# EAGLE design Main_Board_SW (EAGLE 6.4)
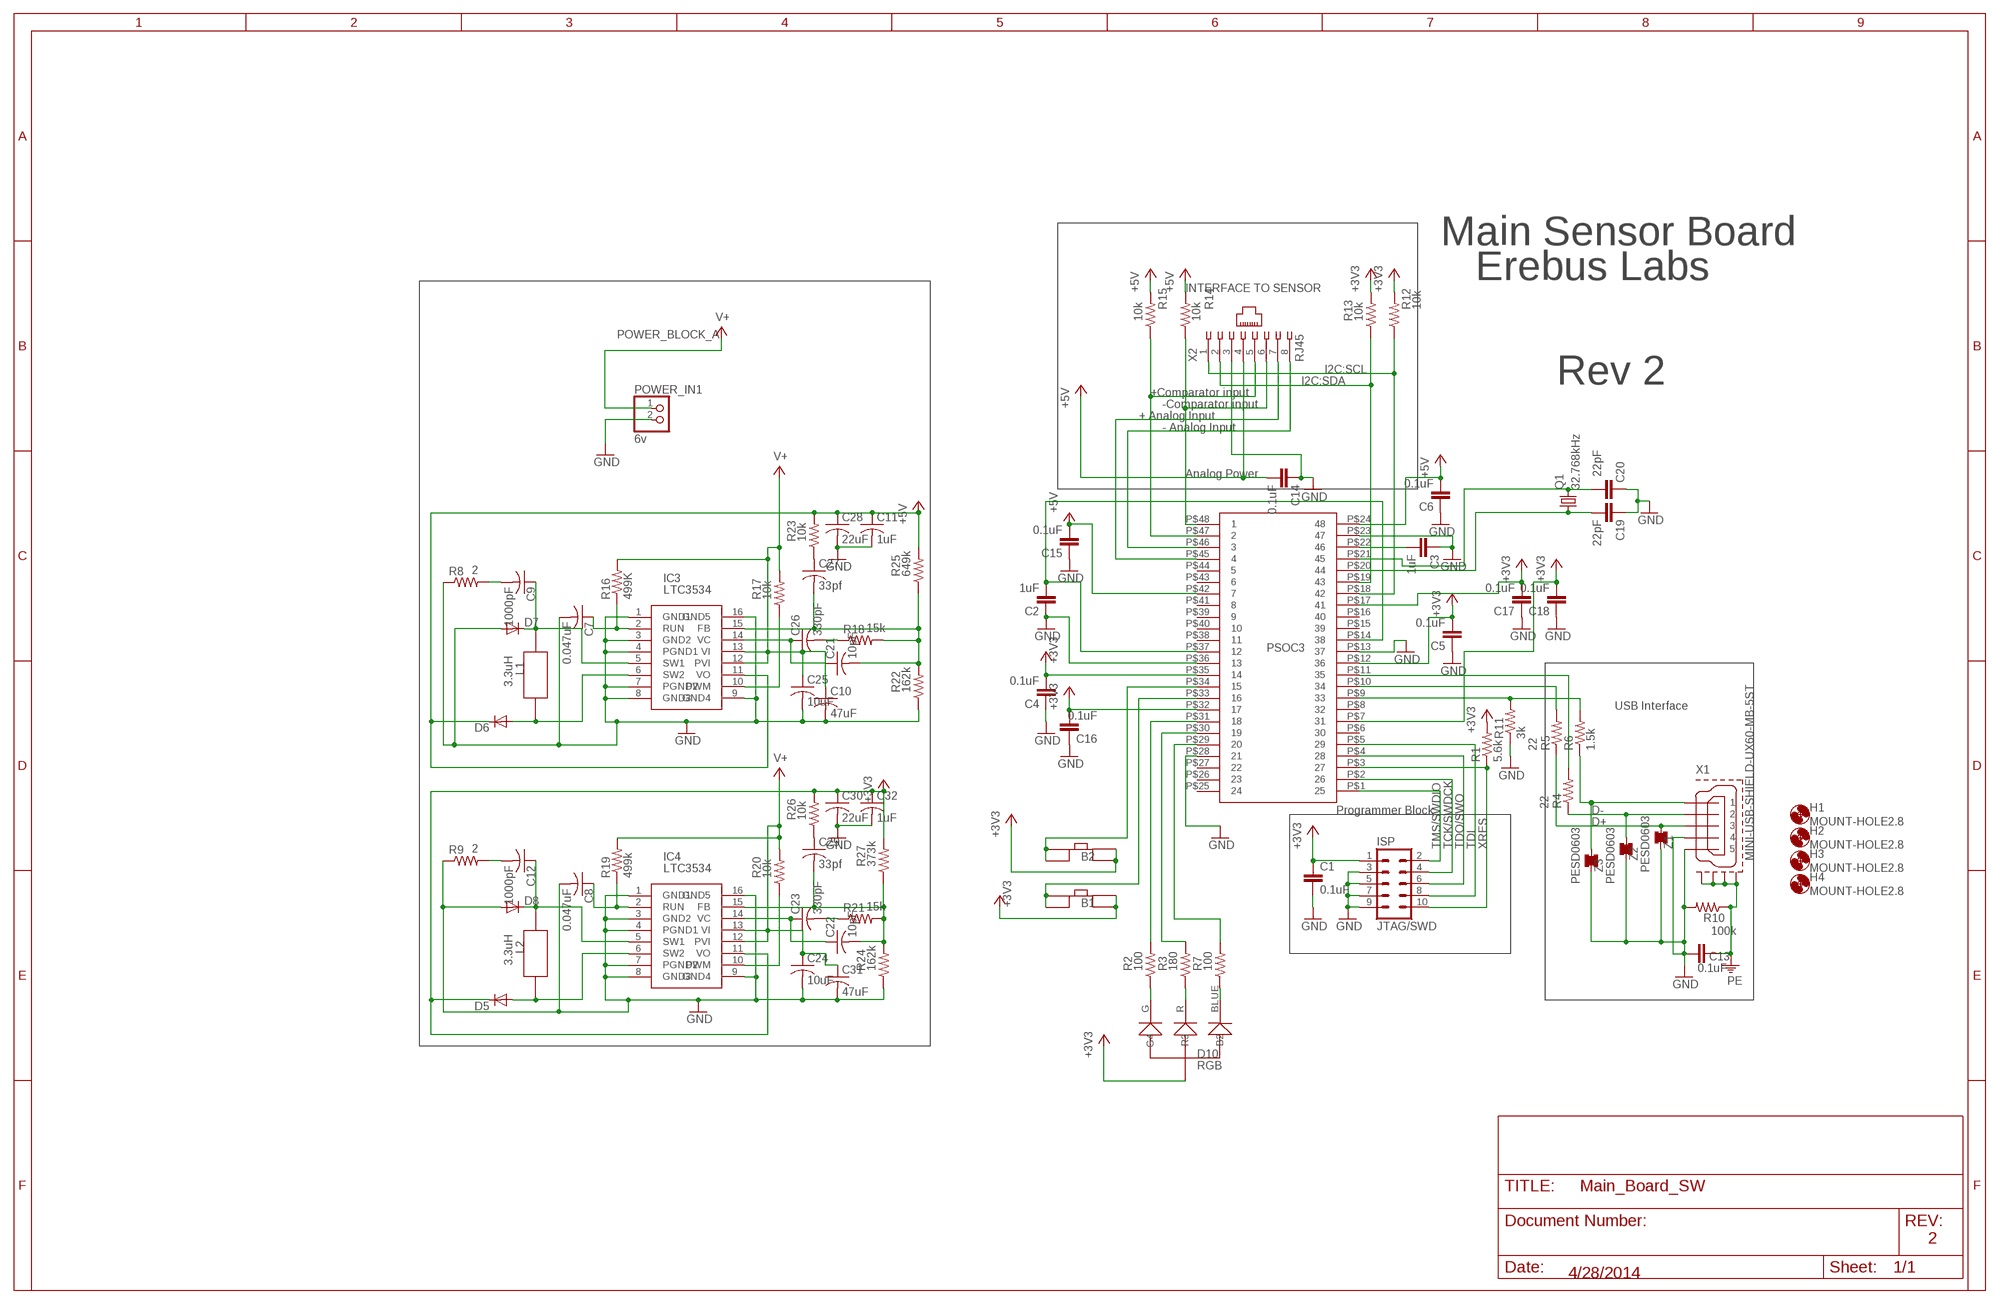
[diagram p0: schematic, sheet 1]

## Parts
C1  0.1uF  C-EUC0603K  [C0603K]
C2  1uF  C-EUC0603  [C0603]
C3  1uF  C-EUC0603  [C0603]
C4  0.1uF  C-EUC0603K  [C0603K]
C5  0.1uF  C-EUC0603K  [C0603K]
C6  0.1uF  C-EUC0603K  [C0603K]
C7  0.047uF  C-USC0402  [C0402]
C8  0.047uF  C-USC0402  [C0402]
C9  1000pF  C-USC0402  [C0402]
C10  47uF  C-USC1210  [C1210]
C11  1uF  C-USC0603  [C0603]
C12  1000pF  C-USC0402  [C0402]
C13  0.1uF  C-EUC0603K  [C0603K]
C14  0.1uF  C-EUC0603K  [C0603K]
C15  0.1uF  C-EUC0603K  [C0603K]
C16  0.1uF  C-EUC0603K  [C0603K]
C17  0.1uF  C-EUC0603K  [C0603K]
C18  0.1uF  C-EUC0603K  [C0603K]
C19  22pF  C-EUC0603  [C0603]
C20  22pF  C-EUC0603  [C0603]
C21  10pF  C-USC0805  [C0805]
C22  10pF  C-USC0805  [C0805]
C23  330pF  C-USC0805  [C0805]
C24  10uF  C-USC0805  [C0805]
C25  10uF  C-USC0805  [C0805]
C26  330pF  C-USC0805  [C0805]
C27  33pf  C-USC0805  [C0805]
C28  22uF  C-USC0805  [C0805]
C29  33pf  C-USC0805  [C0805]
C30  22uF  C-USC0805  [C0805]
C31  47uF  C-USC1210  [C1210]
C32  1uF  C-USC0603  [C0603]
D5  DIODE-SOD323-R  [SOD323-R]
D6  DIODE-SOD323-R  [SOD323-R]
D7  DIODE-SOD323-R  [SOD323-R]
D8  DIODE-SOD323-R  [SOD323-R]
H1  MOUNT-HOLE2.8  [2,8]
H2  MOUNT-HOLE2.8  [2,8]
H3  MOUNT-HOLE2.8  [2,8]
H4  MOUNT-HOLE2.8  [2,8]
ISP  JTAG/SWD  FTSH-105-01-L-DV-K  [FTSH-105-01-L-DV-K]
L1  4.7uH  SHEILDED_COIL  [SHEILDED_COIL]
L2  4.7uH  SHEILDED_COIL  [SHEILDED_COIL]
POWER_IN1  6v  PINHD-1X2  [1X02]
Q1  32.768kHz  CRYSTALTC38H  [TC38H]
R1  5.6k  R-US_R0805  [R0805]
R2  100  R-US_R0805  [R0805]
R3  180  R-US_R0805  [R0805]
R4  22  R-US_R0603  [R0603]
R5  22  R-US_R0603  [R0603]
R6  1.5k  R-US_R0805  [R0805]
R7  100  R-US_R0805  [R0805]
R8  2  R-US_R0402  [R0402]
R9  2  R-US_R0402  [R0402]
R10  100k  R-US_R0805  [R0805]
R11  3k  R-US_R0805  [R0805]
R12  10k  R-US_R0805  [R0805]
R13  10k  R-US_R0805  [R0805]
R14  10k  R-US_R0805  [R0805]
R15  10k  R-US_R0805  [R0805]
R16  499K  R-US_R1206  [R1206]
R17  10k  R-US_R0805  [R0805]
R18  15k  R-US_R0805  [R0805]
R19  499k  R-US_R1206  [R1206]
R20  10k  R-US_R0805  [R0805]
R21  15k  R-US_R0805  [R0805]
R22  162k  R-US_R0805  [R0805]
R23  10k  R-US_R0805  [R0805]
R24  162k  R-US_R0805  [R0805]
R25  649k  R-US_R0805  [R0805]
R26  10k  R-US_R0805  [R0805]
R27  373k  R-US_R0805  [R0805]
REGULATOR_3.3  SWITCHER  [SSOP16]
REGULATOR_5  SWITCHER  [SSOP16]
RGB_LED  RGB_LED  [RGB_LED]
U$1  PSOC_3_48PIN_SSOP  [PSOC_3_48PIN_SSOP]
U$5  SPST  [SPST]
U$6  SPST  [SPST]
X1  MINI-USB-SHIELD-UX60-MB-5ST  [UX60-MB-5ST]
X2  RJ45  555167-1  [555167-1]
Z1  PESD0603  [SMD-0603]
Z2  PESD0603  [SMD-0603]
Z3  PESD0603  [SMD-0603]

## Nets
+3V3: C1.1 C4.2 C5.2 C16.2 C17.2 C18.2 C30.1 C32.1 D5.C ISP.1 R1.2 R12.2 R13.2 R26.2 R27.2 REGULATOR_3.3.11(VO) RGB_LED.VCC(VCC1) U$1.P$7 U$1.P$12 U$1.P$17 U$1.P$32 U$1.P$35 U$5.B1 U$5.B2 U$6.B1 U$6.B2
+5V: C6.2 C11.1 C14.2 C15.2 C28.1 D6.C R14.2 R15.2 R23.2 R25.2 REGULATOR_5.11(VO) U$1.P$24 U$1.P$42 X2.4
ANALOGINPUT: U$1.P$46 X2.8
GND: C1.2 C2.1 C3.1 C4.1 C5.1 C6.1 C7.2 C8.2 C10.2 C11.2 C13.2 C14.1 C15.1 C16.1 C17.1 C18.1 C19.1 C20.1 C24.2 C25.2 C28.2 C30.2 C31.2 C32.2 D7.A D8.A ISP.3 ISP.5 ISP.7 ISP.9 POWER_IN1.2 R8.1 R9.1 R10.2 R11.1 R22.1 R24.1 REGULATOR_3.3.1(GND1) REGULATOR_3.3.3(GND2) REGULATOR_3.3.4(PGND1) REGULATOR_3.3.7(PGND2) REGULATOR_3.3.8(GND3) REGULATOR_3.3.9(GND4) REGULATOR_3.3.16(GND5) REGULATOR_5.1(GND1) REGULATOR_5.3(GND2) REGULATOR_5.4(PGND1) REGULATOR_5.7(PGND2) REGULATOR_5.8(GND3) REGULATOR_5.9(GND4) REGULATOR_5.16(GND5) U$1.P$13 U$1.P$23 U$1.P$28 U$1.P$36 X1.4 X1.5 X2.3 Z1.1 Z2.1 Z3.1
N$1: R4.2 U$1.P$11
N$2: R5.2 U$1.P$10
N$3: R6.2 R11.2 U$1.P$9
N$4: ISP.2 U$1.P$1
N$5: ISP.4 U$1.P$2
N$6: ISP.6 U$1.P$4
N$7: ISP.8 U$1.P$5
N$8: ISP.10 R1.1 U$1.P$3
N$9: C2.2 U$1.P$14 U$1.P$37
N$10: R2.1 RGB_LED.G(G4)
N$11: C3.2 U$1.P$22
N$12: R3.1 RGB_LED.R(R3)
N$13: R5.1 X1.3 Z1.2
N$14: R4.1 X1.2 Z2.2
N$15: R7.1 RGB_LED.BLUE(B2)
N$16: C20.2 Q1.2 U$1.P$21
N$17: R6.1 X1.1 Z3.2
N$18: R15.1 U$1.P$47 X2.5
N$19: R14.1 U$1.P$48 X2.6
N$20: R12.1 U$1.P$18 X2.1
N$23: C19.2 Q1.1 U$1.P$20
N$24: C21.1 C26.1 REGULATOR_5.14(VC)
N$25: C7.1 R16.1 REGULATOR_5.2(RUN)
N$26: C9.1 D7.C L1.P$2 REGULATOR_5.5(SW1)
N$27: R17.1 REGULATOR_5.10(PWM)
N$28: D6.A L1.P$1 REGULATOR_5.6(SW2)
N$29: C26.2 R18.1
N$30: C21.2 C27.2 R18.2 R22.2 R25.1 REGULATOR_5.15(FB)
N$31: C27.1 R23.1
N$32: C8.1 R19.1 REGULATOR_3.3.2(RUN)
N$33: R20.1 REGULATOR_3.3.10(PWM)
N$34: C12.1 D8.C L2.P$2 REGULATOR_3.3.5(SW1)
N$35: D5.A L2.P$1 REGULATOR_3.3.6(SW2)
N$36: C22.1 C23.1 REGULATOR_3.3.14(VC)
N$37: C23.2 R21.1
N$38: C22.2 C29.2 R21.2 R24.2 R27.1 REGULATOR_3.3.15(FB)
N$39: C29.1 R26.1
N$41: U$1.P$34 U$5.A1 U$5.A2
N$42: U$1.P$45 X2.7
N$43: R2.2 U$1.P$31
N$44: U$1.P$33 U$6.A1 U$6.A2
N$46: R3.2 U$1.P$30
N$47: R7.2 U$1.P$29
N$61: R13.1 U$1.P$19 X2.2
N$130: C9.2 R8.2
N$131: C12.2 R9.2
PE: C13.1 R10.1 X1.M1(GND1) X1.M2(GND2) X1.M3(GND3) X1.M4(GND4)
V+: C10.1 C24.1 C25.1 C31.1 POWER_IN1.1 R16.2 R17.2 R19.2 R20.2 REGULATOR_3.3.12(PVI) REGULATOR_3.3.13(VI) REGULATOR_5.12(PVI) REGULATOR_5.13(VI)
Unconnected: U$1.P$6 U$1.P$8 U$1.P$15 U$1.P$16 U$1.P$25 U$1.P$26 U$1.P$27 U$1.P$38 U$1.P$39 U$1.P$40 U$1.P$41 U$1.P$43 U$1.P$44

## Notes on the sheet
- Main Sensor Board
- Erebus Labs
- INTERFACE TO SENSOR
- POWER_BLOCK_A
- I2C:SCL
- I2C:SDA | Rev 2
- +Comparator input
- -Comparator input
- + Analog Input
- - Analog Input
- Analog Power
- IC3
- LTC3534
- PSOC3
- L1
- 3.3uH
- USB Interface
- Programmer Block | D-
- D+
- TMS/SWDIO | TCK/SWDCK | TDO/SWO | TDI | XRES
- IC4 | B2
- LTC3534
- B1
- L2
- 3.3uH
- D10
- RGB
- 2
- 4/28/2014

## Library data of the parts
C1-C6 C13-C20 = rcl:C-EU: CAPACITOR, European symbol
C7-C12 C21-C32 = rcl:C-US: CAPACITOR, American symbol
D5-D8 = diode:DIODE-: DIODE
H1-H4 = holes:MOUNT-HOLE: MOUNTING HOLE with drill center marker
ISP = con-samtec:FTSH-105-01-L-DV-K: FTSH Pin Header
L1 L2 = Inductor:SHEILDED_COIL
POWER_IN1 = pinhead:PINHD-1X2: PIN HEADER
Q1 = crystal:CRYSTAL: CRYSTAL; OC_FARNELL: unknown; OC_NEWARK: unknown
R1-R15 R17 R18 R20-R27 = rcl:R-US_: RESISTOR, American symbol
R16 R19 = resistor:R-US_: RESISTOR, American symbol
REGULATOR_3.3 REGULATOR_5 = linear-technology-2:SWITCHER
RGB_LED = RGB_LED:RGB_LED
U$1 = PSOC_48SSOP:PSOC_3_48PIN_SSOP
U$5 U$6 = Switches_SPST:SPST
X1 = usb_con-update:MINI-USB-SHIELD-: MINI USB Connector Source: http://www.hirose.co.jp/cataloge_hp/e24000019.pdf
X2 = con-amp:555167-1: AMP connector
Z1-Z3 = supressor:PESD: ESD SUPPRESSOR Polymeric ESD Suppressor, Raychem PESD Series

## Board
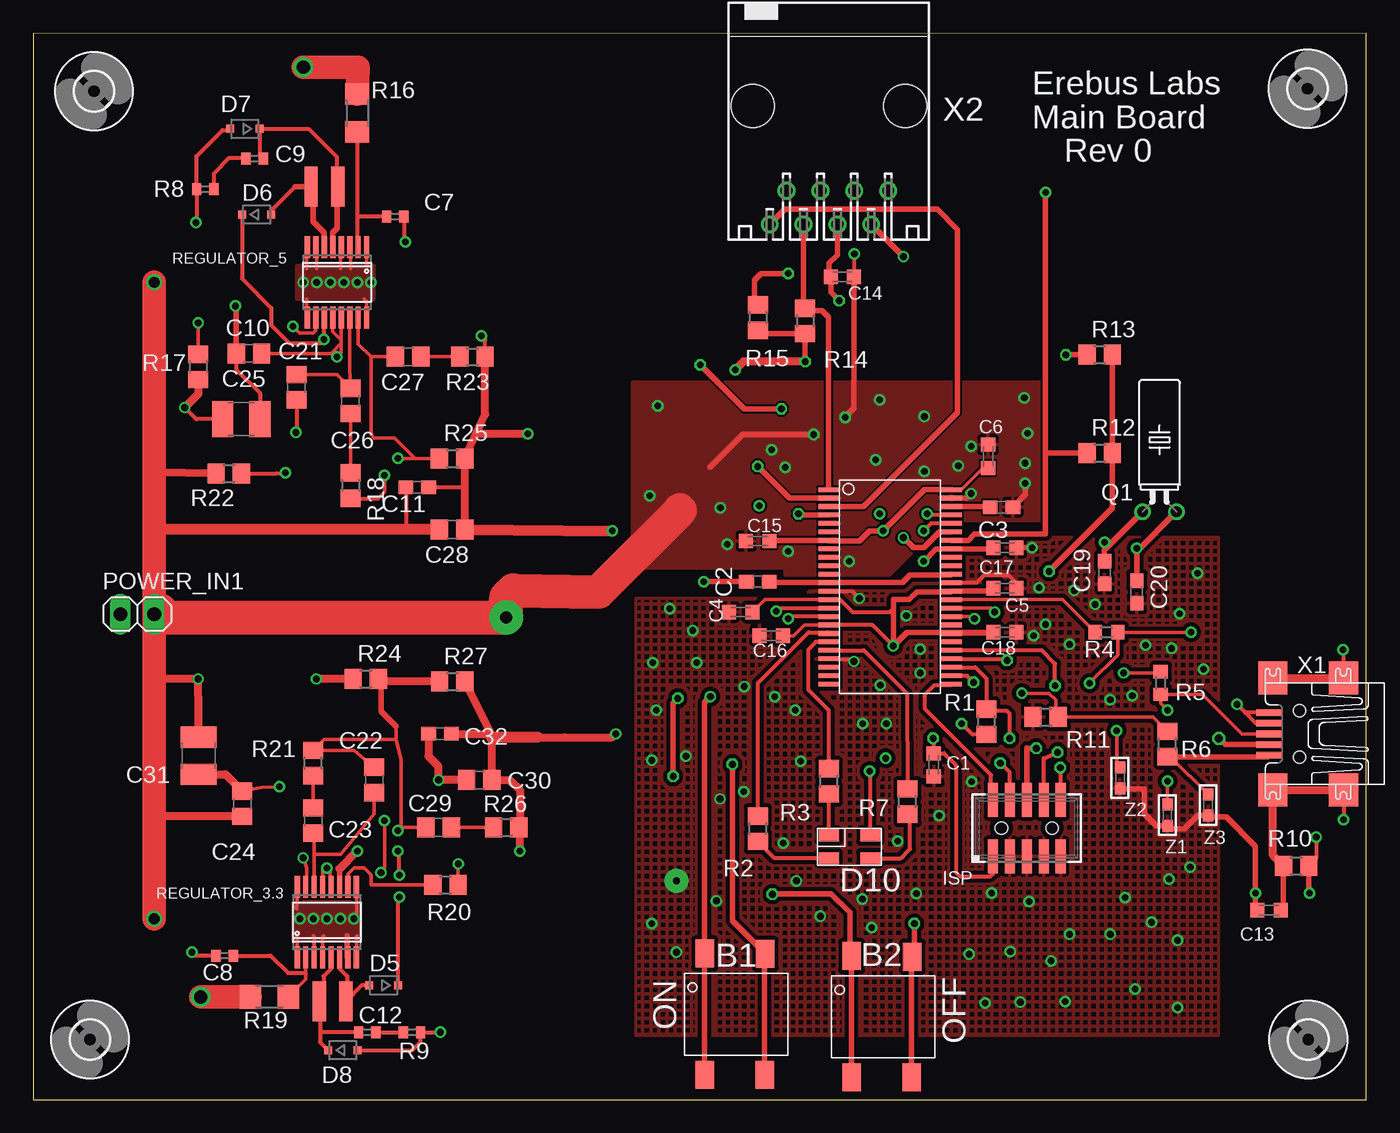
[diagram p1: board, top side]
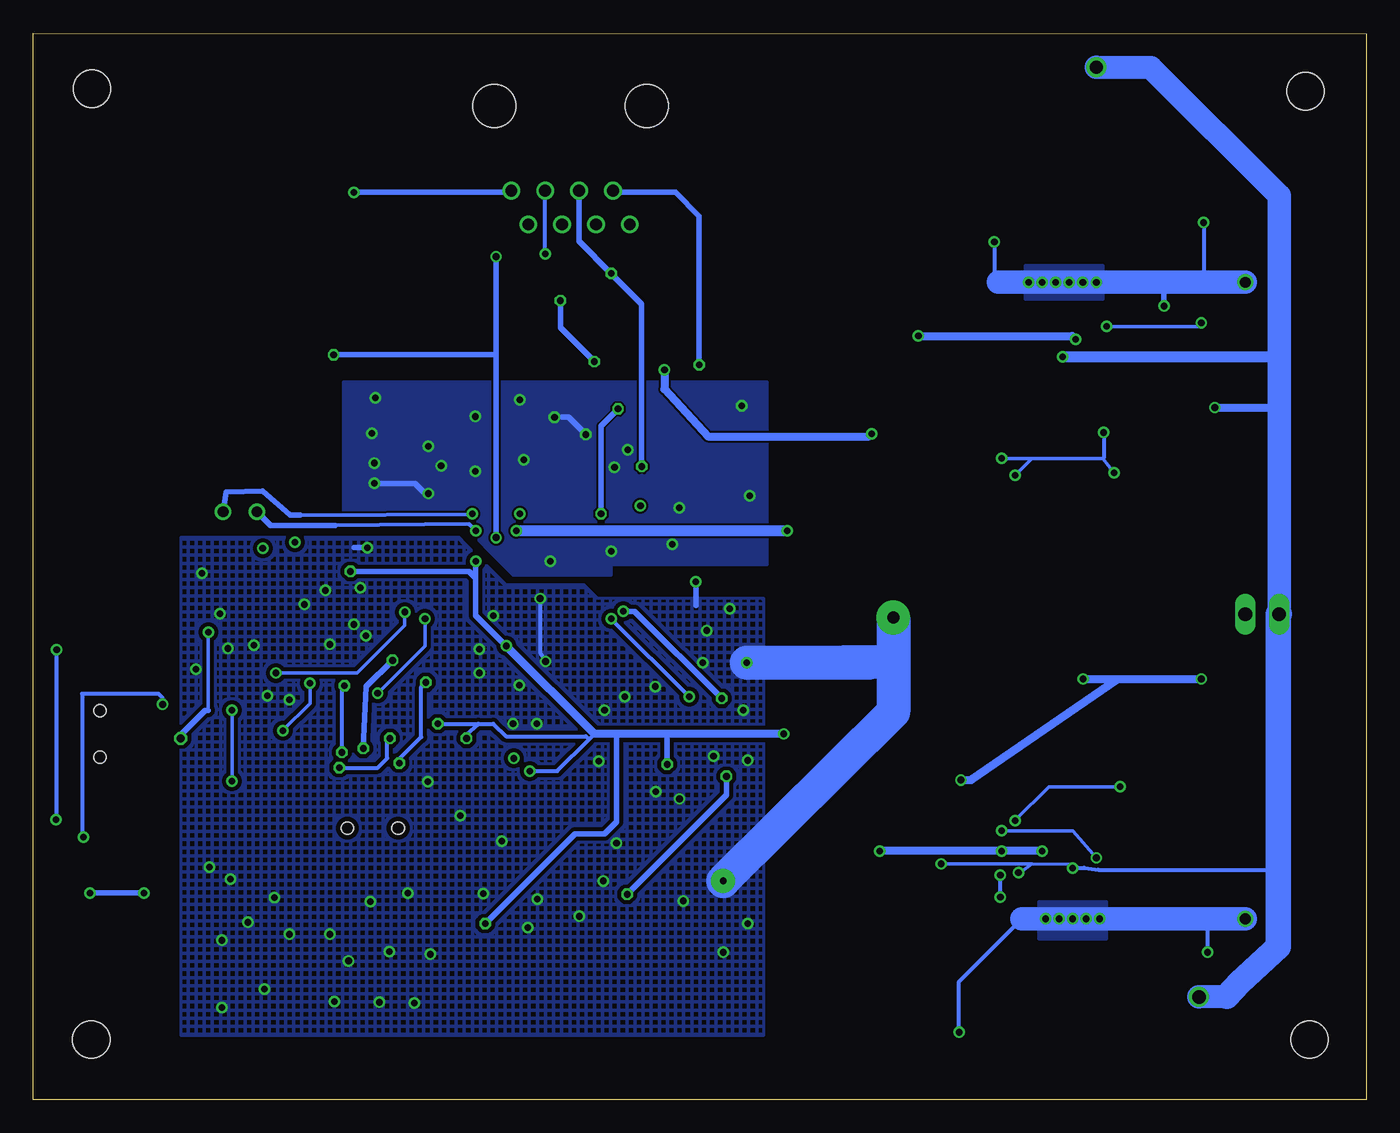
[diagram p2: board, bottom side, seen from below]

Size 100 x 80 mm. Coordinates in mm from the lower left corner, seen from the top.
Outline: 0,0 100,0 100,80 0,79.95 0,0
Copper layers (1*16): Top 0.0356mm / dielectric 1.5011mm / Bottom 0.0356mm
Design rules "LaenPCBOrder": minimum track width 6mil, minimum drill 13mil, track to track 6mil, track to pad 6mil, pad to pad 6mil, via to via 6mil, smd to smd 6mil, copper to edge 15mil, drill to drill 6mil, minimum pad ring 7mil, minimum via ring 7mil, stop-mask expansion 3mil, vias tented up to drill 0mil, thermal gap 10mil

### Footprints (pad centres in the part's own frame; a part is rotated, then mirrored left to right if it is on the bottom)
C0603K = smd 1.05 x 1.08: 1 -0.875,0; 2 0.875,0
C0603 = smd 1.1 x 1: 1 -0.85,0; 2 0.85,0
C0402 = smd 0.7 x 0.9: 1 -0.65,0; 2 0.65,0
C1210 = smd 1.6 x 2.7: 1 -1.4,0; 2 1.4,0
C0805 = smd 1.3 x 1.5: 1 -0.95,0; 2 0.95,0
SOD323-R = smd 0.6 x 0.6: A 1.1,0; C -1.1,0
2,8 = hole 2.8: 0,0
FTSH-105-01-L-DV-K = smd 0.762 x 2.54: 1 -2.54,-2.121; 2 -2.54,2.121; 3 -1.27,-2.121; 4 -1.27,2.121; 5 0,-2.121; 6 0,2.121; 7 1.27,-2.121; 8 1.27,2.121; 9 2.54,-2.121; 10 2.54,2.121 | hole 0.94: -1.905,0; 1.905,0
SHEILDED_COIL = smd 1 x 3: P$1 -2.2,1.1; P$2 -0.2,1.1
1X02 = drill 1.016 long: 1 -1.27,0; 2 1.27,0
TC38H = drill 0.813: 1 -1.27,0; 2 1.27,0
R0805 = smd 1.3 x 1.5: 1 -0.95,0; 2 0.95,0
R0603 = smd 1 x 1.1: 1 -0.85,0; 2 0.85,0
R0402 = smd 0.7 x 0.9: 1 -0.65,0; 2 0.65,0
R1206 = smd 1.6 x 1.803: 1 -1.422,0; 2 1.422,0
SSOP16 = smd 1.65 x 0.4: 1 -2.646,2.223; 2 -2.646,1.587; 3 -2.646,0.953; 4 -2.646,0.318; 5 -2.646,-0.318; 6 -2.646,-0.953; 7 -2.646,-1.587; 8 -2.646,-2.223; 9 2.646,-2.223; 10 2.646,-1.587; 11 2.646,-0.953; 12 2.646,-0.318; 13 2.646,0.318; 14 2.646,0.953; 15 2.646,1.587; 16 2.646,2.223
RGB_LED = smd 1.5 x 0.9: BLUE 3.1,-1.7; G 0,-1.7; R 0,0; VCC 3.1,0
PSOC_3_48PIN_SSOP = smd 0.343 x 1.524: P$1 0.679,-0.827; P$2 1.314,-0.827; P$3 1.949,-0.827; P$4 2.584,-0.827; P$5 3.219,-0.827; P$6 3.854,-0.827; P$7 4.489,-0.827; P$8 5.124,-0.827; P$9 5.759,-0.827; P$10 6.394,-0.827; P$11 7.029,-0.827; P$12 7.664,-0.827; P$13 8.299,-0.827; P$14 8.934,-0.827; P$15 9.569,-0.827; P$16 10.204,-0.827; P$17 10.839,-0.827; P$18 11.474,-0.827; P$19 12.109,-0.827; P$20 12.744,-0.827; P$21 13.379,-0.827; P$22 14.014,-0.827; P$23 14.649,-0.827; P$24 15.284,-0.827; P$25 0.679,8.421; P$26 1.314,8.421; P$27 1.949,8.421; P$28 2.584,8.421; P$29 3.219,8.421; P$30 3.854,8.421; P$31 4.489,8.421; P$32 5.124,8.421; P$33 5.759,8.421; P$34 6.394,8.421; P$35 7.029,8.421; P$36 7.664,8.421; P$37 8.299,8.421; P$38 8.934,8.421; P$39 10.204,8.421; P$40 9.569,8.421; P$41 10.839,8.421; P$42 11.474,8.421; P$43 12.109,8.421; P$44 12.744,8.421; P$45 13.379,8.421; P$46 14.014,8.421; P$47 14.649,8.421; P$48 15.284,8.421
SPST = smd 1.4 x 2.1: A1 0,0; A2 0,-9.1; B1 4.55,-0.05; B2 4.5,-9.1
UX60-MB-5ST = smd 2 x 0.5: 1 2.25,1.6; 2 2.25,0.8; 3 2.25,0; 4 2.25,-0.8; 5 2.25,-1.6 | smd 2.2 x 2.5: M1 -3.3,-4.2; M2 -3.3,4.2; M3 2,4.2; M4 2,-4.2 | hole 0.9: 0,-1.75; 0,1.75
555167-1 = drill 0.889: 1 -4.445,5.207; 2 -3.175,7.747; 3 -1.905,5.207; 4 -0.635,7.747; 5 0.635,5.207; 6 1.905,7.747; 7 3.175,5.207; 8 4.445,7.747 | hole 3.251: -5.715,-1.143; 5.715,-1.143
SMD-0603 = smd 0.9 x 0.8: 1 -0.794,0; 2 0.794,0

### Placement (x,y rotation side)
C1  67.56,25.1 270 top
C2  54.36,38.86 0 top
C3  72.64,44.45 180 top
C4  53.09,36.58 0 top
C5  72.9,38.35 180 top
C6  71.63,48.26 270 top
C7  27.15,66.25 0 top
C8  14.35,10.8 180 top
C9  16.6,70.6 180 top
C10  15.6,51.05 0 top
C11  28.8,45.95 180 top
C12  25.05,5.05 0 top
C13  92.71,14.22 180 top
C14  60.71,61.72 180 top
C15  54.36,41.91 0 top
C16  55.37,34.8 0 top
C17  72.9,41.4 180 top
C18  72.9,35.05 180 top
C19  80.37,39.54 90 top
C20  82.79,38.08 90 top
C21  19.74,53.44 270 top
C22  25.58,23.98 90 top
C23  21.01,20.93 90 top
C24  15.67,22.2 270 top
C25  16.18,55.98 180 top
C26  23.8,52.42 270 top
C27  28.12,55.73 180 top
C28  31.42,42.77 180 top
C29  30.41,20.42 180 top
C30  33.45,23.98 180 top
C31  12.4,25.8 90 top
C32  30.5,27.45 180 top
D5  26.28,8.57 180 top
D6  16.75,66.4 0 top
D7  15.87,72.83 180 top
D8  23.22,3.71 0 top
H1  95.65,4.5 0 top
H2  4.25,4.5 0 top
H3  95.6,75.85 0 top
H4  4.55,75.65 0 top
ISP  74.54,20.36 0 top
L1  23.04,67.41 0 top
L2  21.26,8.48 180 top
POWER_IN1  7.8,36.42 0 top
Q1  84.5,44.1 0 top
R1  71.49,28.34 270 top
R2  54.36,20.32 90 top
R3  59.69,23.88 90 top
R4  80.52,35.05 180 top
R5  84.58,31.24 90 top
R6  85.09,26.67 90 top
R7  65.58,22.35 90 top
R8  12.9,68.3 0 top
R9  28.4,5.05 180 top
R10  94.74,17.53 0 top
R11  75.95,28.7 0 top
R12  80.01,48.51 0 top
R13  80.01,55.88 0 top
R14  57.91,58.42 270 top
R15  54.36,58.67 270 top
R16  24.31,74.02 90 top
R17  12.37,54.96 270 top
R18  23.8,46.07 270 top
R19  17.71,7.72 180 top
R20  30.91,16.1 0 top
R21  21.01,25.25 90 top
R22  14.67,46.98 0 top
R23  32.95,55.73 0 top
R24  24.95,31.56 0 top
R25  31.42,48.11 0 top
R26  35.49,20.42 0 top
R27  31.43,31.36 0 top
REGULATOR_3.3  22.02,13.31 90 top
REGULATOR_5  22.79,61.31 270 top
RGB_LED  59.69,19.81 0 top
U$1  68.07,30.48 90 top
U$5  61.4,10.77 0 top
U$6  50.37,10.97 0 top
X1  95,27.43 180 top
X2  59.69,73.41 180 top
Z1  85.09,21.34 90 top
Z2  81.53,24.13 90 top
Z3  88.14,22.1 90 top

### Tracks (layer width: path | path; a pad name or v marks a point on that pad's centre or on a via)
+3V3  (via drill 0.5 pad 0.25)
  Top 0.254: 36.5,20.35 R26.2 36.5,20.49 | U$1.P$35 54.89,37.51 C4.2 | C16.2 57.05,34.8 57.85,35.6 U$1.P$32
  Top 0.305: U$1.P$7 71.94,34.97 | 39.97,27.27 39.88,27.18 | RGB_LED.VCC 62.79,24.59 v62.74,24.64 | v64.52,34.04 62.95,35.6 U$1.P$32 | U$1.P$35 60.53,37.51 61.47,36.58 64.26,36.58 64.52,36.83 | v67.5,27.1 67.56,26.94 C1.1 68.32,25.98 69.2,25.1 69.2,17.05 69.5,16.75 71.8,16.75 72,16.95 ISP.1 | R1.2 70.46,27.39 v69.65,28.2 | D5.C 27.38,15.13 v27.45,15.2 | v27.45,16.85 27.45,18.54 v27.35,18.64
  Top 0.406: REGULATOR_3.3.11 22.98,17.31 | C17.2 71.94,41.32 U$1.P$17 67.73,41.32 v66.8,40.39 | C5.2 71.81,38.14 U$1.P$12 68.85,38.1 66.29,38.1 65.7,37.51 64.52,37.51 64.52,36.83 v64.52,34.04 65.53,35.05 C18.2 71.94,34.97 | R13.2 R12.2 80.96,44.38 v76.2,39.62 | U$6.B2 54.87,10.87 U$6.B1 52.45,13.39 v52.45,25.15 | U$5.B2 65.9,10.82 U$5.B1 66.1,11.02 v66.1,13.2
  Top 0.61: 22.98,17.31 v24.31,18.64 | v36.5,18.64 36.5,20.35 | 36.5,20.49 36.5,23.21 35.74,23.98 C30.1 34.4,27.1 | 34.4,27.1 34.4,27.28 R27.2 | 37.85,27.18 39.88,27.18 43.43,27.18 v43.69,27.43 | C32.1 34.05,27.45 34.4,27.1
  Top 0.813: 37.85,27.18 34.4,27.18 34.4,27.1
  Bottom 0.305: v62.74,24.64 60.71,24.64 58.32,27.02 | 58.32,27.02 57.91,27.43 | v69.65,28.2 66.6,28.2 | 66.6,28.2 65.5,28.2 64.55,27.25 58.55,27.25 58.32,27.02 | v67.5,27.1 67.5,27.4 66.6,28.2 | v27.45,15.2 v27.45,16.85
  Bottom 0.406: v66.8,40.39 66.8,39.12 | 66.8,39.12 66.8,36.32 v64.52,34.04 | v76.2,39.62 67.31,39.62 66.8,39.12 | v66.1,13.2 59.35,19.95 57.15,19.95 56.25,20.85 56.25,27.43 | v52.45,25.15 52.45,27.38 52.4,27.43
  Bottom 0.61: v24.31,18.64 v27.35,18.64 v36.5,18.64 | v43.69,27.43 52.4,27.43 56.25,27.43 57.91,27.43 v64.52,34.04
+5V  (via drill 0.5 pad 0.25)
  Top 0.254: C6.2 71.26,47.38 69.6,45.72 68.94,45.72 U$1.P$24
  Top 0.305: C11.1 32.32,45.95 32.37,46 | D6.C 15.65,61.6 17.85,59.4 17.85,58.1 19.2,56.75 21.75,56.75 21.8,56.8 v21.8,57.05 21.8,58.63 REGULATOR_5.11 | R23.2 33.9,57 v33.6,57.3 | 33.36,49.95 33.1,49.69
  Top 0.406: C15.2 55.27,41.95 U$1.P$42 59.7,41.91 61.98,41.91 62.74,42.67 v63.75,42.67 66.85,45.76 U$1.P$24 | X2.4 60.33,63.37 59.69,62.74 59.69,61.86 C14.2 59.83,60.56 v60.45,59.94 | R15.2 54.61,57.47 R14.2 v57.91,55.37
  Top 0.61: R23.2 33.9,51.41 33.1,49.69 R25.2 32.37,46 C28.1 | v57.91,55.37 53.27,55.37 v52.65,54.75 | v37.1,49.95 33.36,49.95
  Top 0.813: C28.1 v43.43,42.67
  Bottom 0.305: 22.05,57.3 v21.8,57.05 | 37.3,49.75 v37.1,49.95
  Bottom 0.406: v60.45,59.94 60.45,57.91 v57.91,55.37
  Bottom 0.61: v33.6,57.3 22.05,57.3 | v52.65,54.75 52.65,53.3 49.4,49.75 37.3,49.75
  Bottom 0.813: v43.43,42.67 v63.75,42.67
ANALOGINPUT
  Top 0.406: U$1.P$46 62.27,44.49 69.34,51.56 69.34,65.28 67.82,66.8 56.39,66.8 X2.8
GND  (via drill 0.5 pad 0.25, 0.5 pad 1.78, 0.8 pad 0.41, 0.9 pad 2.54)
  Top 0.254: 20.5,62.33 20.5,63.85 REGULATOR_5.8 | 21.26,62.33 21.26,63.85 REGULATOR_5.7 | 23.04,62.33 23.04,63.85 REGULATOR_5.4 | 23.8,62.33 23.8,63.85 REGULATOR_5.3 | 20.5,60.04 20.5,58.77 REGULATOR_5.9 | REGULATOR_5.16 25.01,59.85 24.82,60.04 | REGULATOR_5.1 25.01,62.65 25.07,62.58 | REGULATOR_3.3.1 19.8,12.23 19.74,12.29 | REGULATOR_3.3.3 21.07,12.23 21.01,12.29 | REGULATOR_3.3.4 21.71,12.23 21.77,12.29 | REGULATOR_3.3.8 24.25,12.23 24.31,12.29 | 19.74,14.32 19.74,14.83 19.8,14.9 REGULATOR_3.3.16 19.74,16.02 | 9.32,42.77 9.07,43.03 | 9.26,21.25 9.07,21.69 | REGULATOR_3.3.9 24.25,13.75 v24.06,13.56 | 59.7,33.02 61.42,33.02 v61.57,32.87
  Top 0.305: 9.32,42.77 9.32,41.76 9.58,41.76 9.58,36.68 | U$1.P$13 70.78,38.78 71.37,39.37 73.15,39.37 73.66,38.86 73.66,38.47 C5.1 | U$1.P$36 61.42,38.14 v61.98,37.59 | 59.7,33.02 U$1.P$28 | X1.4 91.72,28.23 90.92,29.03 | 90.92,29.03 v90.3,29.65 | X1.5 90.92,29.03 | v96.25,19.7 96.25,18.08 R10.2 | C14.1 61.6,61.72 v61.6,63.45 | v12.2,65.8 12.25,65.85 R8.1 12.25,70.8 14.2,72.75 14.69,72.75 D7.A | C25.2 15.23,54.77 17,53 C10.2 | C11.2 27.95,43.02 27.7,42.77 | C7.2 27.8,64.45 v27.9,64.35 | 29.05,5 R9.1 | D8.A 28.41,3.71 29.05,4.35 29.05,5 | 29.05,5 29,5.05 v30.55,5.05 | C8.2 12.15,10.8 v11.9,11.05
  Top 0.406: C25.2 15.23,59.47 v15.17,59.54 | REGULATOR_3.3.7 23.55,10.66 23.55,12.29 | C2.1 v50.29,38.86 | U$1.P$23 70.02,45.13 v70.36,45.47 | v74.42,46.23 74.42,45.38 C3.1 | C13.2 91.69,14.37 v91.69,15.49 91.69,19.01 89.5,21.2 88.24,21.2 Z3.1 87.35,21.3 86.35,20.3 85.33,20.3 Z1.1 84.26,20.54 83.35,21.45 83.35,23.25 83.3,23.3 81.57,23.3 Z2.1 | v95.76,15.49 95.69,15.56 R10.2 | C17.1 v74.93,41.4 | C14.1 61.58,51.88 v60.9,51.2 | v58.55,49.9 53.2,49.9 50.75,47.45 | R11.1 74.6,28.7
  Top 0.61: R24.1 v21.24,31.56 | 9.07,31.56 v12.37,31.56 12.4,29.03 C31.2 | C30.2 v30.41,23.98 30.35,24.03 30.35,25.05 29.65,25.75 C32.2 | C24.2 9.26,21.25 | R22.1 9.13,47.03 9.07,49.12
  Top 0.813: C28.2 27.7,42.77 9.32,42.77 9.07,42.52
  Top 1.778: v9.07,13.56 9.07,21.69 9.07,31.56 POWER_IN1.2 9.07,42.52 9.07,43.03 9.07,49.12 v9.07,61.31
  Top 2.54: 9.58,36.68 9.58,36.17 v35.49,36.17 35.49,37.69 35.99,38.2 42.42,38.1 48.51,44.2
  Bottom 0.305: v61.98,37.59 61.98,33.53 v61.57,32.87 | v90.3,29.65 90.3,30.15 90.6,30.45 96.35,30.45 96.35,19.75 v96.25,19.7 | v61.6,63.45 v61.59,63.45 X2.3 | v12.2,65.8 12.2,61.36 12.15,61.31 | v27.9,64.35 27.9,61.6 27.61,61.31 | v30.55,5.05 30.55,8.85 25.83,13.56 | v11.9,11.05 11.9,13.51 11.85,13.56
  Bottom 0.406: v15.17,59.54 15.17,61.06 15.42,61.31 | v50.29,38.86 50.29,37.08 | v70.36,45.47 70.61,45.47 71.37,46.23 v74.42,46.23 | v91.69,15.49 v95.76,15.49 | v74.93,41.4 75.95,41.4 | v60.9,51.2 59.85,51.2 v58.55,49.9
  Bottom 0.61: v21.24,31.56 18.62,31.56 | 18.62,31.56 v12.37,31.56 | v30.41,23.98 29.64,23.98 18.62,31.56
  Bottom 1.778: 27.61,61.31 v25.33,61.31 v24.31,61.31 v23.29,61.31 v22.28,61.31 v21.26,61.31 v20.25,61.31 15.42,61.31 12.15,61.31 v9.07,61.31 | v9.07,13.56 11.85,13.56 v19.99,13.56 v21.01,13.56 v22.02,13.56 v23.04,13.56 v24.06,13.56 25.83,13.56
  Bottom 2.54: 37.34,32.77 v46.48,32.77 35.74,32.87 35.49,33.12 | v35.49,36.17 35.49,33.12 | 35.49,33.12 35.49,29.06 v48.25,16.4
  other vias: 51.25,14.9 46.4,13.2 48.25,11.05 46.4,25.45 48.96,25.76 51.52,22.56 53.3,23.1 57.58,25.39 57.25,16.4 59.05,13.75 62.9,12.9 73.3,11.1 62.2,15.05 66.25,15.45 56.25,19.25 64.85,19.4 71.9,15.5 74.7,14.85 70.2,10.9 71.4,7.25 74.05,7.3 76.35,10.4 77.4,7.35 77.75,12.4 80.8,12.4 82.65,8.3 85.85,6.9 85.85,11.95 83.9,13.3 81.9,15.15 85.2,16.55 86.8,17.45 70.4,23.85 67.95,21.3 62.23,28.19 64.01,28.19 63.55,31.1 80.8,30 82.45,30.3 83.45,34.1 85.4,33.85 87.8,32.3 86,36.45 75.95,35.65 75.05,34.8 87.35,39.5 79.65,37.15 78.1,38.2 65.5,36.3 66.55,33.78 66.55,32 75.45,38.4 77.75,34.15 46.74,29.21 47.75,36.83 53.34,30.99 55.63,30.23 57.15,29.21 49.78,32.77 49.47,35.19 61.21,40.39 56.64,41.15 52.07,41.66 51.55,44.4 46.25,45.3 55.4,48.75 56.4,47.45 66.85,51.25 63.5,52.5 63.2,48 66.85,47.15 69.4,47.55 70.36,49.02 74.35,52.65 74.6,50 74.42,47.75 46.85,52.05
  pour Top: 19.74,62.58 25.58,62.58 25.58,60.04 19.74,60.04
  pour Bottom: 19.74,62.58 25.58,62.58 25.58,60.04 19.74,60.04
  pour Bottom: 19.48,14.83 24.56,14.83 24.56,12.04 19.48,12.04
  pour Top: 19.48,14.83 24.56,14.83 24.56,12.04 19.48,12.04
  pour Bottom: 52.07,40.13 56.64,40.13 56.64,39.37 64.01,39.37 68.33,43.69 76.71,43.69 76.71,46.74 76.71,53.85 44.96,53.85 44.96,46.74 44.96,40.39 44.96,40.13
  pour Top: 44.96,53.85 44.96,39.88 56.39,39.88 56.39,39.37 64.26,39.37 68.33,43.43 76.71,43.43 76.71,53.85
  pour Bottom (isolate 0.305, rank 4, hatched): 45.21,37.59 57.66,37.59 58.67,38.61 64.52,38.61 67.56,41.66 68.07,42.16 76.71,42.16 88.9,42.16 88.9,30.99 88.9,4.83 45.21,4.83
  pour Top (isolate 0.305, rank 4, hatched): 45.21,37.59 57.66,37.59 58.67,38.61 64.52,38.61 68.07,42.16 88.9,42.16 88.9,4.83 45.21,4.83 45.21,37.34
N$1
  Top 0.254: U$1.P$11 77.21,37.51 R4.2
N$2  (via drill 0.5 pad 0.25)
  Top 0.254: U$1.P$10 71.84,36.87 v72.14,36.58 | v81.79,32 84.49,32 R5.2
  Bottom 0.254: v72.14,36.58 72.14,35.56 75.69,32 v81.79,32
N$3  (via drill 0.5 pad 0.25)
  Top 0.254: U$1.P$9 70.19,36.24 v70.61,36.07 | v74.17,30.48 76.2,30.48 76.71,29.97 76.71,28.89 R11.2 84.01,28.7 R6.2
  Bottom 0.254: v70.61,36.07 70.61,34.04 v74.17,30.48
N$4
  Top 0.305: 71.85,22.63 71.85,24.35 66.9,29.3 66.9,30.4 67.6,31.1 68.84,31.1 U$1.P$1
  Top 0.406: 71.85,22.63 ISP.2
N$5  (via drill 0.5 pad 0.25)
  Top 0.305: ISP.4 73.27,24.53 v72.55,25.25 | v70.55,31.3 70.06,31.79 U$1.P$2
  Bottom 0.305: v72.55,25.25 72.55,25.55 70.9,27.2 70.9,30.95 v70.55,31.3
N$6  (via drill 0.5 pad 0.25)
  Top 0.305: U$1.P$4 72.99,33.06 v73.05,32.95
  Top 0.406: ISP.6 74.54,26.39 v75.25,26.35
  Bottom 0.406: v75.25,26.35 75.05,31 v73.05,32.95
N$7  (via drill 0.5 pad 0.25)
  Top 0.305: ISP.8 75.81,25.14 75.8,25.15 75.8,25.6 v76.85,26.05 | v76.65,31.05 76.65,32.7 75.65,33.7 U$1.P$5
  Bottom 0.305: v76.85,26.05 76.85,30.85 v76.65,31.05
N$8  (via drill 0.5 pad 0.25)
  Top 0.305: ISP.10 77.08,24.87 v77.05,24.9 | v73.25,27.1 73.25,28.95 73.05,29.15 71.63,29.15 R1.1 71.5,29.3 71.5,31.6 70.67,32.43 U$1.P$3
  Bottom 0.305: v77.05,24.9 74.15,24.9 73.45,25.6 73.45,26.9 v73.25,27.1
N$9
  Top 0.406: U$1.P$14 68.85,39.37 65.79,39.37 65.19,38.78 U$1.P$37 55.29,38.78 C2.2
N$10
  Top 0.305: RGB_LED.G 55.61,18.11 R2.1
N$11
  Top 0.406: U$1.P$22 71.75,44.49 C3.2
N$12
  Top 0.305: RGB_LED.R R3.1
N$13  (via drill 0.5 pad 0.25)
  Top 0.254: X1.3 90.68,27.43 87.72,30.39 R5.1 84.58,29.72 v85.09,29.21 | v85.09,23.88 Z1.2
  Bottom 0.254: v85.09,29.21 v85.09,23.88
N$14  (via drill 0.5 pad 0.25, 0.6)
  Top 0.254: v86.87,35.05 R4.1 81.37,33.36 v79.25,31.24 | 92.71,26.67 X1.2 | v81.28,27.69 81.28,25.18 Z2.2
  Top 0.406: v88.95,27.1 89.42,26.63 X1.2
  Bottom 0.254: v86.87,35.05 86.87,29.21 | v79.25,31.24 79.25,29.72 v81.28,27.69
  Bottom 0.406: 86.87,29.21 87.09,29.21 89.05,27.25 88.95,27.15 v88.95,27.1
N$15
  Top 0.305: RGB_LED.BLUE 65.1,18.11 65.79,18.8 65.79,21.15 R7.1
N$16  (via drill 0.5 pad 0.25)
  Top 0.305: U$1.P$21 67.06,43.86 v67.06,43.94 | v82.79,41.37 C20.2
  Top 0.406: C20.2 82.79,41.13 Q1.2
  Bottom 0.305: 80,43.84 v67.06,43.94
  Bottom 0.406: 80,43.84 80.74,43.84 82.8,45.65 85.52,45.6 Q1.2
N$17
  Top 0.254: R6.1 85.31,25.72 Z3.2
  Top 0.406: X1.1 92.63,25.72 R6.1
N$18  (via drill 0.5 pad 0.25)
  Top 0.406: v56.64,61.98 54.61,61.98 54.1,61.47 54.1,59.88 R15.1 | U$1.P$47 56.73,45.13 v54.36,47.5
  Bottom 0.406: X2.5 59.05,64.39 v56.64,61.98 54.36,59.69 v54.36,47.5
N$19
  Top 0.406: X2.6 57.78,59.5 R14.1 58.1,59.18 59.18,59.18 59.65,58.71 U$1.P$48
N$20  (via drill 0.5 pad 0.25)
  Top 0.406: U$1.P$18 70.15,41.95 70.61,42.42 75.95,42.42 75.95,48.51 | v75.95,68.07 75.95,48.77 75.95,48.51 | R12.1 75.95,48.51
  Bottom 0.406: v75.95,68.07 64.26,68.07 X2.1
N$21  (via drill 0.5 pad 0.25)
  other vias: 54.45,44.55
N$23  (via drill 0.5 pad 0.25)
  Top 0.305: U$1.P$20 67.35,43.22 v66.8,42.67 | v80.37,41.8 C19.2
  Top 0.406: C19.2 80.37,41.25 Q1.1
  Bottom 0.305: v66.8,42.67 67.31,43.18 77.34,43.08
  Bottom 0.406: 77.34,43.08 82.2,43.08 Q1.1
N$24
  Top 0.254: REGULATOR_5.14 23.74,54.83 C26.1 22.79,54.39 C21.1
N$25
  Top 0.305: R16.1 24.31,66.1 | 24.31,66.1 24.31,64.02 REGULATOR_5.2 | C7.1 24.46,66.25 24.31,66.1
N$26
  Top 0.305: 22.79,68.46 22.79,70.71 20.7,72.8 16.99,72.8 | 16.99,72.8 D7.C | 16.99,72.8 16.99,70.86 C9.1
  Top 0.406: REGULATOR_5.5 22.47,65.06 22.79,65.38 22.79,68.46 L1.P$2
N$27  (via drill 0.5 pad 0.25)
  Top 0.254: REGULATOR_5.10 21.2,57.69 21.01,57.5 19.99,57.5 v19.48,58.01 | v12.37,58.27 R17.1
  Bottom 0.254: v19.48,58.01 12.63,58.01 v12.37,58.27
N$28
  Top 0.305: 19.65,68.51 17.85,66.71 D6.A
  Top 0.406: REGULATOR_5.6 21.83,65.06 21.01,65.89 21.01,67.16 20.75,67.41 20.75,68.42 L1.P$1 19.65,68.51
N$29
  Top 0.254: C26.2 R18.1
N$30  (via drill 0.5 pad 0.25)
  Top 0.254: R25.1 28.63,48.11 | 28.63,48.11 v27.36,48.11 | REGULATOR_5.15 24.37,56.68 25.33,55.73 | 25.33,55.73 25.33,49.88 25.58,49.63 27.1,49.63 28.63,48.11 | C27.2 25.33,55.73 | v26.34,46.84 26.34,45.57 25.83,45.06
  Top 0.305: R22.2 18.26,46.98 v18.92,47.03 | C21.2 19.74,50.09 v19.7,50.05 | 25.83,45.06 23.87,45.06 R18.2
  Bottom 0.254: v27.36,48.11 25.07,48.11 | v18.92,47.03 19.74,48.11 25.07,48.11 | 25.07,48.11 v26.34,46.84
  Bottom 0.305: v19.7,50.05 19.7,48.14 19.74,48.11
N$31
  Top 0.254: R23.1 C27.1
N$32
  Top 0.254: REGULATOR_3.3.2 20.44,9.4 20.44,9.03 R19.1
  Top 0.305: C8.1 17.8,10.8 19.1,9.5 20.34,9.5 20.44,9.4
N$33
  Top 0.254: REGULATOR_3.3.10 23.61,16.93 24.06,17.37 24.82,17.37 25.33,16.86 25.33,16.1 R20.1
N$34
  Top 0.305: REGULATOR_3.3.5 22.34,9.82 21.77,9.24 21.77,7.69 L2.P$2 21.52,7.33 21.52,5.25 | 21.52,5.25 21.52,4.31 D8.C | C12.1 21.72,5.05 21.52,5.25
N$35
  Top 0.305: REGULATOR_3.3.6 22.98,9.82 23.55,9.24 23.55,7.47 L2.P$1 24.65,8.57 D5.A
N$36
  Top 0.254: REGULATOR_3.3.14 21.07,18.39 | 21.07,18.39 21.07,19.91 C23.1 | C22.1 25.58,21.44 23.04,18.39 21.07,18.39
N$37
  Top 0.254: C23.2 R21.1
N$38  (via drill 0.5 pad 0.25)
  Top 0.254: C22.2 24.06,26.2 R21.2 21.84,27.02 27.22,27.02 | C29.2 27.61,20.42 | 27.61,20.42 v27.36,20.17 | v20.25,18.13 20.5,17.37 20.5,16.02 REGULATOR_3.3.15 | 27.22,27.99 27.22,27.02 | 27.61,20.42 27.61,25.5 27.22,27.02
  Top 0.406: 26.1,31.36 26.1,29.11 27.22,27.99
  Top 0.61: R27.1 26.1,31.36 R24.2
  Bottom 0.254: v27.36,20.17 22.02,20.17 v20.25,18.13
N$39
  Top 0.254: R26.1 C29.1
N$40  (via drill 0.5 pad 0.25)
  other vias: 63.5,43.94
N$41  (via drill 0.5 pad 0.25)
  Top 0.305: v55.73,36.63 55.92,36.87 U$1.P$34
  Top 0.406: v55.45,15.4 55.5,15.45 59.85,15.45 61.25,14.05 61.25,10.92 U$5.A1 U$5.A2 | v48,24.25 48,29.75 v48.35,30.1
  Bottom 0.406: v55.45,15.4 48,22.85 v48,24.25 | v48.35,30.1 54.88,36.63 v55.73,36.63
N$42  (via drill 0.5 pad 0.25)
  Top 0.406: U$1.P$45 57.49,43.86 v57.4,43.94 | v56.13,51.82 53.34,51.82 v50.04,55.12
  Bottom 0.406: v57.4,43.94 57.4,50.55 v56.13,51.82 | v50.04,55.12 50.04,66.29 51.82,68.07 56.39,68.07 X2.7
N$43
  Top 0.305: R2.2 54.36,31.24 58.17,35.05 59.57,35.05 U$1.P$31
N$44  (via drill 0.5 pad 0.25)
  Top 0.305: U$1.P$33 56.81,36.24 v56.64,36.07
  Top 0.406: U$6.A2 U$6.A1 50.37,29.8 v50.8,30.23
  Bottom 0.305: v56.64,36.07 v50.8,30.23
N$46
  Top 0.305: R3.2 59.69,29.21 58.17,30.73 58.17,33.78 58.72,34.33 U$1.P$30
N$47
  Top 0.305: U$1.P$29 62.31,33.7 65.53,30.48 R7.2
N$61  (via drill 0.5 pad 0.25)
  Top 0.406: U$1.P$19 67.99,42.59 66.8,41.4 66.04,41.4 v65.28,42.16 | v65.28,63.25 X2.2 | R13.1 v77.47,55.88
  Bottom 0.406: v65.28,42.16 65.28,55.63 65.28,55.88 | 65.28,55.88 v65.28,63.25 | v77.47,55.88 65.28,55.88
N$90  (via drill 0.5 pad 0.25)
  other vias: 63.95,25.6
N$130
  Top 0.305: R8.2 13.55,69.5 14.7,70.65 15.9,70.65 C9.2
N$131
  Top 0.305: C12.2 R9.2
PE  (via drill 0.5 pad 0.25)
  Top 0.305: X1.M2 98.35,23.23 v98.3,21 | v98.25,33.75 98.3,33.75 X1.M1
  Top 0.406: C13.1 93.79,14.43 R10.1
  Top 0.61: X1.M4 X1.M1 | X1.M2 X1.M3 93,18.32 R10.1
  Bottom 0.305: v98.3,21 98.25,21.55 v98.25,33.75
V+  (via drill 0.5 pad 0.25, 1)
  Top 0.254: REGULATOR_5.13 23.1,57 | 23.1,57 23.1,56.74 | 23.1,56.74 23.1,56.04 v22.79,55.73 | REGULATOR_5.12 22.47,57.63 23.1,57 | C25.1 22.34,55.98 23.1,56.74 | R20.2 31.86,17.71 v31.88,17.68 | v22.02,17.37 22.28,17.12 22.28,16.02 REGULATOR_3.3.12 | REGULATOR_3.3.13 21.71,17.31 | C24.1 17.13,23.4 v18.47,23.47 | v26.34,20.93 26.34,17.37 v26.09,17.02
  Top 0.305: 21.71,17.31 21.96,17.31 v22.02,17.37 | C10.1 12.22,51.05 v11.36,51.92
  Top 0.61: R17.2 12.37,52.93 v11.36,51.92 | C31.1 14.42,24.4 C24.1
  Top 1.778: R16.2 24.35,77.45 v20.25,77.45 | R19.2 v12.55,7.7
  Bottom 0.254: v31.88,17.68 25.07,17.68 | 25.07,17.68 22.28,17.63 v22.02,17.37 | v18.47,23.47 23.8,23.47 v26.34,20.93 | v26.09,17.02 25.83,17.12 25.07,17.68
  Bottom 0.305: v22.02,17.37 22.02,17.58 21.65,17.4 21.15,17.4 20.1,17.25 6.6,17.25 6.4,17.25
  Bottom 0.61: v11.36,51.92 6.53,51.92 | 6.6,11.45 6.6,17.25
  Bottom 0.813: v22.79,55.73 6.53,55.73
  Bottom 1.778: POWER_IN1.1 6.53,51.92 6.53,55.73 6.53,67.81 16.15,77.43 v20.25,77.45 | v12.55,7.7 10.45,7.75
  Bottom 1.93: POWER_IN1.1 6.6,36.42 6.6,11.45 9.5,8.8 10.45,7.75

### Text on the board
tNames: Erebus Labs | Main Board | Rev 0 | D10 | B1 | B2 | ON | OFF